# Altium schematic sheet ExternalConnectors.SchDoc: Title
size A4; SchTemplateVer: V2.0; Author: Adam Mizerkiewicz; CompanyName: Adam Mizerkiewicz; DrawnBy: Adam Mizerkiewicz; Engineer: Adam Mizerkiewicz; Organization: Adam Mizerkiewicz; Address1: Sarnia 2/19; Address2: 61-058 Poznań; Revision: 0.0
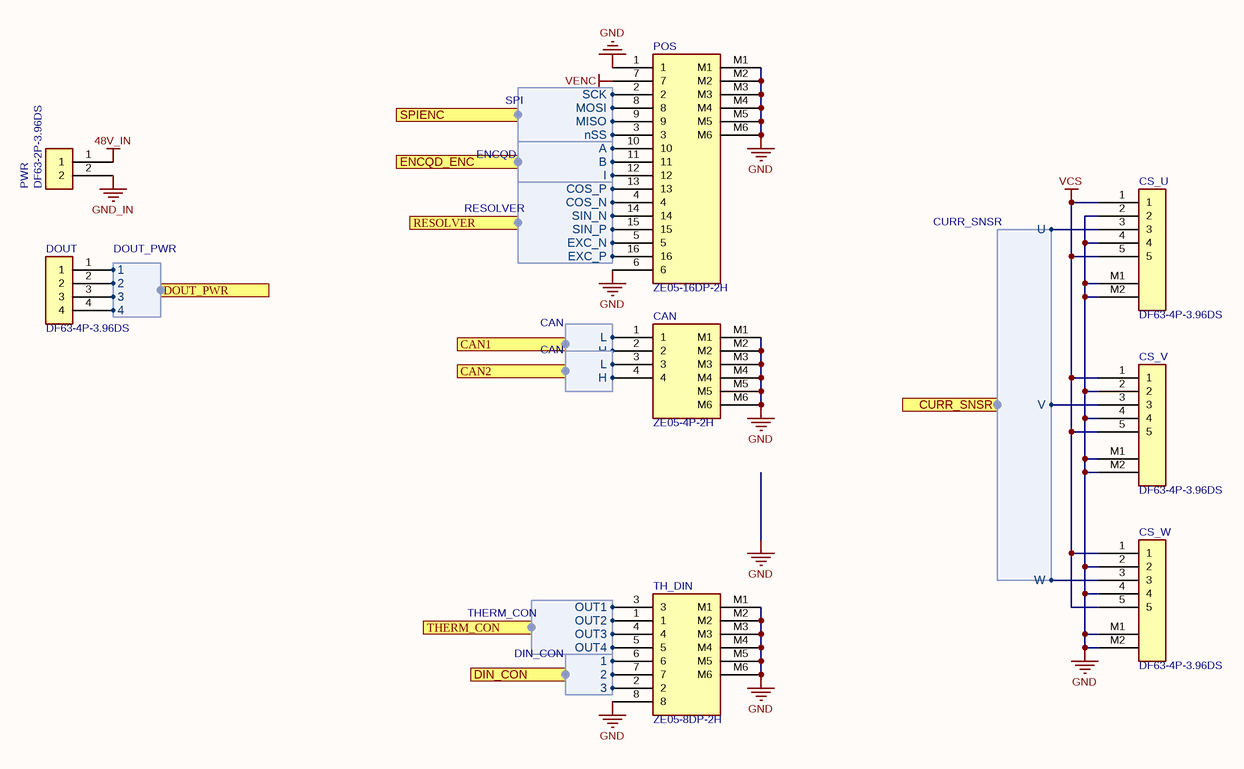
[diagram p0: ExternalConnectors.SchDoc]

## Parts
CAN  ZE05-4P-2H  [ZE05-4P-2H]
CS_U  DF63-4P-3.96DS  [FH34SRJ-5S-0.5SH(99)]
CS_V  DF63-4P-3.96DS  [FH34SRJ-5S-0.5SH(99)]
CS_W  DF63-4P-3.96DS  [FH34SRJ-5S-0.5SH(99)]
DOUT  DF63-4P-3.96DS  [HRS_DF63-4P-3.96DS]
POS  ZE05-16DP-2H  [ZE05-16DP-2H]
PWR  DF63-2P-3.96DS  [HRS_DF63-2P-3.96DS]
TH_DIN  ZE05-8DP-2H  [ZE05-8DP-2H]

## Ports
CAN1 (harness CAN), CAN2 (harness CAN), CURR_SNSR (harness CURR_SNSR), DIN_CON (harness DIN_CON), DOUT_PWR (harness DOUT_PWR), ENCQD_ENC (harness ENCQD), RESOLVER (harness RESOLVER), SPIENC (harness SPI), THERM_CON (harness THERM_CON)

## Harnesses
CAN: H, L
DOUT_PWR: 1, 2, 3, 4
ENCQD: B, A, I
SPI: MISO, MOSI, SCK, nSS
RESOLVER: EXC_P, EXC_N, SIN_P, SIN_N, COS_P, COS_N
CURR_SNSR: V, U, W
THERM_CON: OUT1, OUT2, OUT3, OUT4
DIN_CON: 1, 2, 3

## Nets
48V_IN: PWR.1
GND: CAN.M1 CAN.M2 CAN.M3 CAN.M4 CAN.M5 CAN.M6 CS_U.2 CS_U.4 CS_U.M1 CS_U.M2 CS_V.2 CS_V.4 CS_V.M1 CS_V.M2 CS_W.2 CS_W.4 CS_W.M1 CS_W.M2 POS.1 POS.6 POS.M1 POS.M2 POS.M3 POS.M4 POS.M5 POS.M6 TH_DIN.8 TH_DIN.M1 TH_DIN.M2 TH_DIN.M3 TH_DIN.M4 TH_DIN.M5 TH_DIN.M6
GND_IN: PWR.2
VCS: CS_U.1 CS_U.5 CS_V.1 CS_V.5 CS_W.1 CS_W.5
VENC: POS.7
NetCAN_1: CAN.1 ; port CAN1.L
NetCAN_2: CAN.2 ; port CAN1.H
NetCAN_3: CAN.3 ; port CAN2.L
NetCAN_4: CAN.4 ; port CAN2.H
NetCS_U_3: CS_U.3 ; port CURR_SNSR.U
NetCS_V_3: CS_V.3 ; port CURR_SNSR.V
NetCS_W_3: CS_W.3 ; port CURR_SNSR.W
NetDOUT_1: DOUT.1 ; port DOUT_PWR.1
NetDOUT_2: DOUT.2 ; port DOUT_PWR.2
NetDOUT_3: DOUT.3 ; port DOUT_PWR.3
NetDOUT_4: DOUT.4 ; port DOUT_PWR.4
NetPOS_2: POS.2 ; port SPIENC.SCK
NetPOS_3: POS.3 ; port SPIENC.nSS
NetPOS_4: POS.4 ; port RESOLVER.COS_N
NetPOS_5: POS.5 ; port RESOLVER.EXC_N
NetPOS_8: POS.8 ; port SPIENC.MOSI
NetPOS_9: POS.9 ; port SPIENC.MISO
NetPOS_10: POS.10 ; port ENCQD_ENC.A
NetPOS_11: POS.11 ; port ENCQD_ENC.B
NetPOS_12: POS.12 ; port ENCQD_ENC.I
NetPOS_13: POS.13 ; port RESOLVER.COS_P
NetPOS_14: POS.14 ; port RESOLVER.SIN_N
NetPOS_15: POS.15 ; port RESOLVER.SIN_P
NetPOS_16: POS.16 ; port RESOLVER.EXC_P
NetTH_DIN_1: TH_DIN.1 ; port THERM_CON.OUT2
NetTH_DIN_2: TH_DIN.2 ; port DIN_CON.3
NetTH_DIN_3: TH_DIN.3 ; port THERM_CON.OUT1
NetTH_DIN_4: TH_DIN.4 ; port THERM_CON.OUT3
NetTH_DIN_5: TH_DIN.5 ; port THERM_CON.OUT4
NetTH_DIN_6: TH_DIN.6 ; port DIN_CON.1
NetTH_DIN_7: TH_DIN.7 ; port DIN_CON.2

## Notes on the sheet
- Revision
  =Revision
- Sheet
  =SheetNumber / =SheetTotal

## Library data of the parts
CAN = ZE05-4P-2H: Automotive Connectors Right Angle Receptacle, DIP Solder Tabs, 4 Position; Manufacturer: HIROSE ELECTRIC; Supplier 1: DigiKey; Supplier Part Number 1: 26-ZE05-4P-2HCT-ND; Supplier: DigiKey; Supplier Part Number: 26-ZE05-4P-2HCT-ND; Manufacturer Part Number: ZE05-4P-2H; RoHS: Compliant; Category: Card Edge Connectors; Stock: 351; Pricing: 1=1,69, 10=1,434, 25=1,3444, 50=1,28, 100=1,2188 (USD); Connector Type: Receptacle; Contact Plating: Tin; Height: 8.34mm; Length: 16.32mm; Lifecycle Status: Production; Max Operating Temperature: 125°C; Min Operating Temperature: -40°C; Pins: 4; Orientation: Right Angle; REACH SVHC: Yes; Width: 14.8mm; ComponentLink1URL: https://datasheet.octopart.com:443/ZE05-4P-2H-HIROSE-ELECTRIC-datasheet-180012703.pdf?src-supplier=IHS; ComponentLink1Description: https://datasheet.octopart.com:443/ZE05-4P-2H-HIROSE-ELECTRIC-datasheet-180012703.pdf?src-supplier=IHS; ComponentLink2URL: https://datasheet.octopart.com:443/ZE05-4P-2H-HIROSE-ELECTRIC-datasheet-189101943.pdf?src-supplier=Master+Electronics; ComponentLink2Description: https://datasheet.octopart.com:443/ZE05-4P-2H-HIROSE-ELECTRIC-datasheet-189101943.pdf?src-supplier=Master+Electronics; ComponentLink3URL: https://datasheet.octopart.com:443/ZE05-4P-2H-HIROSE-ELECTRIC-datasheet-188748195.pdf?src-supplier=Master+Electronics; ComponentLink3Description: https://datasheet.octopart.com:443/ZE05-4P-2H-HIROSE-ELECTRIC-datasheet-188748195.pdf?src-supplier=Master+Electronics; ComponentLink4URL: https://datasheet.octopart.com:443/ZE05-4P-2H-HIROSE-ELECTRIC-datasheet-181928072.pdf?src-supplier=Electro+Sonic; ComponentLink4Description: https://datasheet.octopart.com:443/ZE05-4P-2H-HIROSE-ELECTRIC-datasheet-181928072.pdf?src-supplier=Electro+Sonic; ComponentLink5URL: https://datasheet.octopart.com:443/ZE05-4P-2H-HIROSE-ELECTRIC-datasheet-176457996.pdf?src-supplier=Future+Electronics; ComponentLink5Description: https://datasheet.octopart.com:443/ZE05-4P-2H-HIROSE-ELECTRIC-datasheet-176457996.pdf?src-supplier=Future+Electronics; ComponentLink6URL: https://datasheet.octopart.com:443/ZE05-4P-2H-Hirose-datasheet-168215454.pdf?src-supplier=TME; ComponentLink6Description: https://datasheet.octopart.com:443/ZE05-4P-2H-Hirose-datasheet-168215454.pdf?src-supplier=TME; ComponentLink7URL: https://datasheet.octopart.com:443/ZE05-4P-2H-Hirose-datasheet-149155786.pdf?src-supplier=Sager+Electronics; ComponentLink7Description: https://datasheet.octopart.com:443/ZE05-4P-2H-Hirose-datasheet-149155786.pdf?src-supplier=Sager+Electronics; ComponentLink8URL: https://datasheet.octopart.com:443/ZE05-4P-2H-Hirose-datasheet-137351164.pdf?src-supplier=Sager+Electronics; ComponentLink8Description: https://datasheet.octopart.com:443/ZE05-4P-2H-Hirose-datasheet-137351164.pdf?src-supplier=Sager+Electronics; ComponentLink9URL: https://sigma.octopart.com:443/145369994/technical_drawing/Hirose-ZE05-4P-2H.pdf?src-supplier=Hirose+SCT; ComponentLink9Description: https://sigma.octopart.com:443/145369994/technical_drawing/Hirose-ZE05-4P-2H.pdf?src-supplier=Hirose+SCT; ComponentLink10URL: https://datasheet.octopart.com:443/ZE05-4P-2H-Hirose-datasheet-141146741.pdf?src-supplier=Hirose+SCT; ComponentLink10Description: https://datasheet.octopart.com:443/ZE05-4P-2H-Hirose-datasheet-141146741.pdf?src-supplier=Hirose+SCT
CS_U CS_V CS_W = FH34SRJ-5S-0.5SH(99): RoHS Compliant Tape & Reel (TR) (Flat Flex Type) (Connector/Contact Type) Connector; Manufacturer: HIROSE ELECTRIC; Supplier 1: DigiKey; Supplier Part Number 1: FH34SRJ-5S-0.5SH(99)-ND; Supplier: DigiKey; Supplier Part Number: FH34SRJ-5S-0.5SH(99)-ND; Manufacturer Part Number: FH34SRJ-5S-0.5SH(99); RoHS: Compliant; Category: Card Edge Connectors; Pricing: 500=1,20602 (USD); Lifecycle Status: Production; REACH SVHC: Yes; ComponentLink1URL: https://datasheet.octopart.com:443/FH34SRJ-5S-0.5SH%2899%29-HIROSE-ELECTRIC-datasheet-151619939.pdf?src-supplier=IHS; ComponentLink1Description: https://datasheet.octopart.com:443/FH34SRJ-5S-0.5SH%2899%29-HIROSE-ELECTRIC-datasheet-151619939.pdf?src-supplier=IHS; ComponentLink2URL: https://datasheet.octopart.com:443/FH34SRJ-5S-0.5SH%2899%29-Hirose-datasheet-145364452.pdf?src-supplier=Hirose+SCT; ComponentLink2Description: https://datasheet.octopart.com:443/FH34SRJ-5S-0.5SH%2899%29-Hirose-datasheet-145364452.pdf?src-supplier=Hirose+SCT; ComponentLink3URL: https://sigma.octopart.com:443/145364455/technical_drawing/Hirose-FH34SRJ-5S-0.5SH%2899%29.pdf?src-supplier=Hirose+SCT; ComponentLink3Description: https://sigma.octopart.com:443/145364455/technical_drawing/Hirose-FH34SRJ-5S-0.5SH%2899%29.pdf?src-supplier=Hirose+SCT; ComponentLink4URL: https://datasheet.octopart.com:443/FH34SRJ-5S-0.5SH%2899%29-Hirose-datasheet-137333288.pdf?src-supplier=Sager+Electronics; ComponentLink4Description: https://datasheet.octopart.com:443/FH34SRJ-5S-0.5SH%2899%29-Hirose-datasheet-137333288.pdf?src-supplier=Sager+Electronics
DOUT = HRS_DF63-4P-3.96DS: Supplier 1: DigiKey; Supplier Part Number 1: DF63-4P-3.96DS-ND
POS = ZE05-16DP-2H: Automotive Conn, R/A Header, 16Pos, 2A Rohs Compliant: Yes |Hirose/hrs ZE05-16DP-2H; Manufacturer: HIROSE ELECTRIC; Connector Type: Receptacle; Supplier 1: DigiKey; Supplier Part Number 1: 26-ZE05-16DP-2HCT-ND; Supplier: DigiKey; Supplier Part Number: 26-ZE05-16DP-2HCT-ND; Manufacturer Part Number: ZE05-16DP-2H; RoHS: Compliant; Category: Card Edge Connectors; Stock: 286; Pricing: 1=2,43, 10=2,068, 25=1,9384, 50=1,8458, 100=1,7576 (USD); Height: 8.84mm; Length: 28.52mm; Lifecycle Status: Production; Max Operating Temperature: 125°C; Min Operating Temperature: -40°C; Pins: 16; Orientation: Right Angle; REACH SVHC: Yes; Width: 14.8mm; ComponentLink1URL: https://datasheet.octopart.com:443/ZE05-16DP-2H-HIROSE-ELECTRIC-datasheet-180012703.pdf?src-supplier=IHS; ComponentLink1Description: https://datasheet.octopart.com:443/ZE05-16DP-2H-HIROSE-ELECTRIC-datasheet-180012703.pdf?src-supplier=IHS; ComponentLink2URL: https://datasheet.octopart.com:443/ZE05-16DP-2H-HIROSE-ELECTRIC-datasheet-189101943.pdf?src-supplier=Master+Electronics; ComponentLink2Description: https://datasheet.octopart.com:443/ZE05-16DP-2H-HIROSE-ELECTRIC-datasheet-189101943.pdf?src-supplier=Master+Electronics; ComponentLink3URL: https://datasheet.octopart.com:443/ZE05-16DP-2H-HIROSE-ELECTRIC-datasheet-188748195.pdf?src-supplier=Master+Electronics; ComponentLink3Description: https://datasheet.octopart.com:443/ZE05-16DP-2H-HIROSE-ELECTRIC-datasheet-188748195.pdf?src-supplier=Master+Electronics; ComponentLink4URL: https://datasheet.octopart.com:443/ZE05-16DP-2H-HIROSE-ELECTRIC-datasheet-181928072.pdf?src-supplier=Electro+Sonic; ComponentLink4Description: https://datasheet.octopart.com:443/ZE05-16DP-2H-HIROSE-ELECTRIC-datasheet-181928072.pdf?src-supplier=Electro+Sonic; ComponentLink5URL: https://datasheet.octopart.com:443/ZE05-16DP-2H-Hirose-datasheet-141146741.pdf?src-supplier=Hirose+SCT; ComponentLink5Description: https://datasheet.octopart.com:443/ZE05-16DP-2H-Hirose-datasheet-141146741.pdf?src-supplier=Hirose+SCT; ComponentLink6URL: https://sigma.octopart.com:443/145369985/technical_drawing/Hirose-ZE05-16DP-2H.pdf?src-supplier=Hirose+SCT; ComponentLink6Description: https://sigma.octopart.com:443/145369985/technical_drawing/Hirose-ZE05-16DP-2H.pdf?src-supplier=Hirose+SCT; ComponentLink7URL: https://datasheet.octopart.com:443/ZE05-16DP-2H-HIROSE-ELECTRIC-datasheet-176457996.pdf?src-supplier=Future+Electronics; ComponentLink7Description: https://datasheet.octopart.com:443/ZE05-16DP-2H-HIROSE-ELECTRIC-datasheet-176457996.pdf?src-supplier=Future+Electronics; ComponentLink8URL: https://datasheet.octopart.com:443/ZE05-16DP-2H-Hirose-datasheet-158236516.pdf?src-supplier=Future+Electronics; ComponentLink8Description: https://datasheet.octopart.com:443/ZE05-16DP-2H-Hirose-datasheet-158236516.pdf?src-supplier=Future+Electronics; ComponentLink9URL: https://datasheet.octopart.com:443/ZE05-16DP-2H-Hirose-datasheet-168215454.pdf?src-supplier=TME; ComponentLink9Description: https://datasheet.octopart.com:443/ZE05-16DP-2H-Hirose-datasheet-168215454.pdf?src-supplier=TME
PWR = HRS_DF63-2P-3.96DS
TH_DIN = ZE05-8DP-2H: Automotive Connectors Right Angle Receptacle, DIP Solder Tabs, 8 Position; Manufacturer: HIROSE ELECTRIC; Supplier 1: DigiKey; Supplier Part Number 1: 26-ZE05-8DP-2HCT-ND; Supplier: DigiKey; Supplier Part Number: 26-ZE05-8DP-2HCT-ND; Manufacturer Part Number: ZE05-8DP-2H; RoHS: Compliant; Category: Card Edge Connectors; Stock: 76; Pricing: 1=1,89, 10=1,609, 25=1,5084, 50=1,4362, 100=1,3676 (USD); Connector Type: Receptacle; Height: 8.84mm; Length: 18.52mm; Lifecycle Status: Production; Max Operating Temperature: 125°C; Min Operating Temperature: -40°C; Pins: 8; Orientation: Right Angle; REACH SVHC: Yes; Width: 14.8mm; ComponentLink1URL: https://datasheet.octopart.com:443/ZE05-8DP-2H-HIROSE-ELECTRIC-datasheet-180012703.pdf?src-supplier=IHS; ComponentLink1Description: https://datasheet.octopart.com:443/ZE05-8DP-2H-HIROSE-ELECTRIC-datasheet-180012703.pdf?src-supplier=IHS; ComponentLink2URL: https://datasheet.octopart.com:443/ZE05-8DP-2H-HIROSE-ELECTRIC-datasheet-189101943.pdf?src-supplier=Master+Electronics; ComponentLink2Description: https://datasheet.octopart.com:443/ZE05-8DP-2H-HIROSE-ELECTRIC-datasheet-189101943.pdf?src-supplier=Master+Electronics; ComponentLink3URL: https://datasheet.octopart.com:443/ZE05-8DP-2H-HIROSE-ELECTRIC-datasheet-188748195.pdf?src-supplier=Master+Electronics; ComponentLink3Description: https://datasheet.octopart.com:443/ZE05-8DP-2H-HIROSE-ELECTRIC-datasheet-188748195.pdf?src-supplier=Master+Electronics; ComponentLink4URL: https://datasheet.octopart.com:443/ZE05-8DP-2H-HIROSE-ELECTRIC-datasheet-181928072.pdf?src-supplier=Electro+Sonic; ComponentLink4Description: https://datasheet.octopart.com:443/ZE05-8DP-2H-HIROSE-ELECTRIC-datasheet-181928072.pdf?src-supplier=Electro+Sonic; ComponentLink5URL: https://datasheet.octopart.com:443/ZE05-8DP-2H-HIROSE-ELECTRIC-datasheet-176457996.pdf?src-supplier=Future+Electronics; ComponentLink5Description: https://datasheet.octopart.com:443/ZE05-8DP-2H-HIROSE-ELECTRIC-datasheet-176457996.pdf?src-supplier=Future+Electronics; ComponentLink6URL: https://datasheet.octopart.com:443/ZE05-8DP-2H-Hirose-datasheet-168215454.pdf?src-supplier=TME; ComponentLink6Description: https://datasheet.octopart.com:443/ZE05-8DP-2H-Hirose-datasheet-168215454.pdf?src-supplier=TME; ComponentLink7URL: https://datasheet.octopart.com:443/ZE05-8DP-2H-Hirose-datasheet-149155786.pdf?src-supplier=Sager+Electronics; ComponentLink7Description: https://datasheet.octopart.com:443/ZE05-8DP-2H-Hirose-datasheet-149155786.pdf?src-supplier=Sager+Electronics; ComponentLink8URL: https://sigma.octopart.com:443/145369997/technical_drawing/Hirose-ZE05-8DP-2H.pdf?src-supplier=Hirose+SCT; ComponentLink8Description: https://sigma.octopart.com:443/145369997/technical_drawing/Hirose-ZE05-8DP-2H.pdf?src-supplier=Hirose+SCT; ComponentLink9URL: https://datasheet.octopart.com:443/ZE05-8DP-2H-Hirose-datasheet-141146741.pdf?src-supplier=Hirose+SCT; ComponentLink9Description: https://datasheet.octopart.com:443/ZE05-8DP-2H-Hirose-datasheet-141146741.pdf?src-supplier=Hirose+SCT